# Altium schematic sheet Sheet2.SchDoc
size A4; SheetNumber: 1; SheetTotal: 1; SPICEModelCacheLSWSENKY: <root> / <DocumentId>LSWSENKY</DocumentId> / <CacheFrame Number="0"> / <Model Name="led1" Kind="MDL"> / <Text>*Typ RED GaAs LED: Vf=1.7V Vr=4V If=40mA trr=3uS / *LED Pinout: 1=A, 2=K / .MODEL LED1 D (IS=93.2P RS=42M N=3.73 BV=4 IBV=10U / + CJO=2.97P VJ=.75 M=.333 TT=4.32U)</Text> / </Model> / </CacheFrame> / </root>
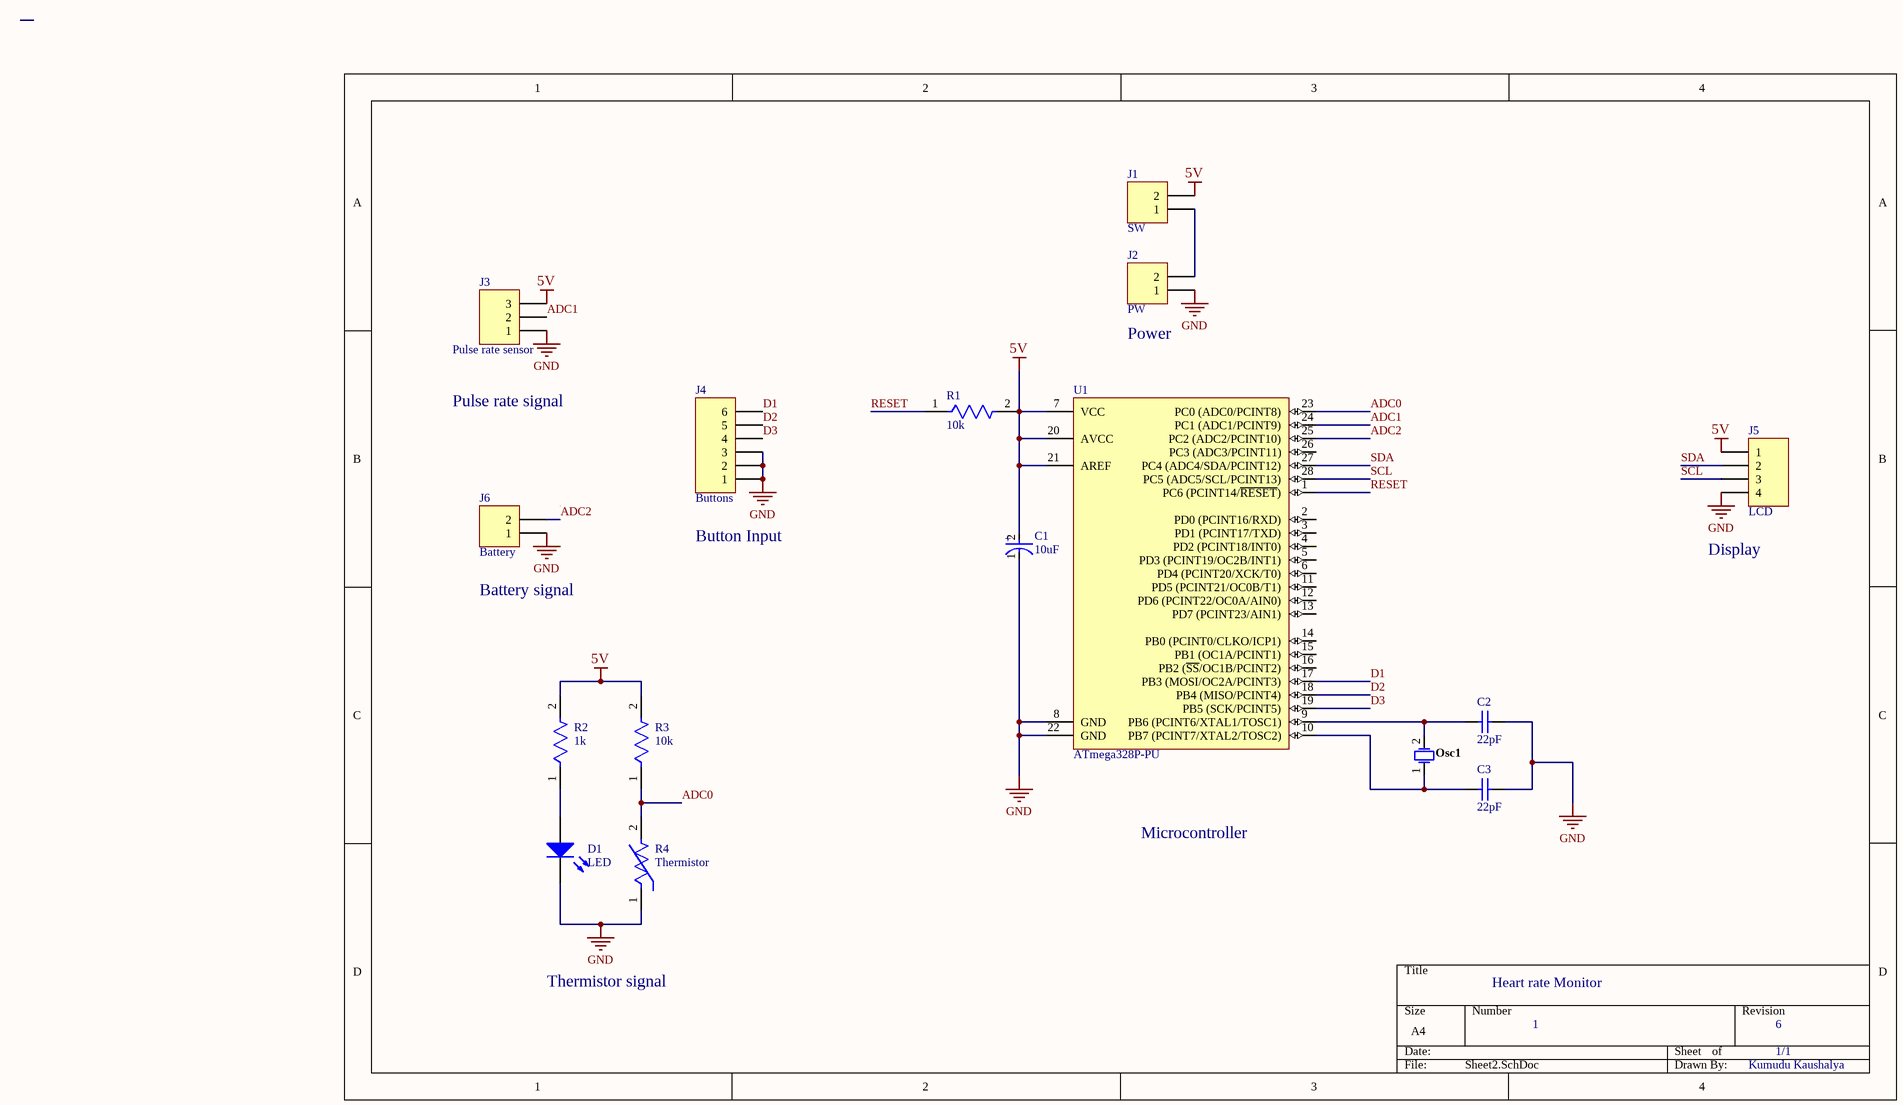
[diagram p0: Sheet2.SchDoc]

## Parts
C1  10uF  [FP-RAD-TH-D_5_0_5-L_11_1-MFG]
C2  22pF  [KEMT-C315-THT-2]
C3  22pF  [KEMT-C315-THT-2]
D1  LED  [LED-1]
J1  SW  [HDR1X2]
J2  PW  [HDR1X2]
J3  Pulse rate sensor  [HDR1X3]
J4  Buttons  [HDR1X6]
J5  LCD  [HDR1X4]
J6  Battery  [HDR1X2]
Osc1  Osc1  [FOX-FOXSLF160-20]  (value not drawn)
R1  10k  [FP-MBB0207-MFG]
R2  1k  [FP-MRS25-MFG]
R3  10k  [FP-MBB0207-MFG]
R4  Thermistor  [FP-NTCLE100E3104JB0-MFG]
U1  ATmega328P-PU  [28P3]

## Nets
5V: C1.2(A) J1.2 J3.3 J5.1 R1.2 R2.2 R3.2 U1.7(VCC) U1.20(AVCC) U1.21(AREF)
GND: C1.1(C) C2.2 C3.2 D1.2(K) J2.1 J3.1 J4.1 J4.2 J4.3 J5.4 J6.1 R4.1 U1.8(GND) U1.22(GND)
ADC0: R3.1 R4.2 U1.23(PC0_(ADC0/PCINT8))
ADC1: J3.2 U1.24(PC1_(ADC1/PCINT9))
ADC2: J6.2 U1.25(PC2_(ADC2/PCINT10))
D1: J4.6 U1.17(PB3_(MOSI/OC2A/PCINT3))
D2: J4.5 U1.18(PB4_(MISO/PCINT4))
D3: J4.4 U1.19(PB5_(SCK/PCINT5))
RESET: R1.1 U1.1(PC6_(PCINT14/~{RESET}))
SCL: J5.3 U1.28(PC5_(ADC5/SCL/PCINT13))
SDA: J5.2 U1.27(PC4_(ADC4/SDA/PCINT12))
NetC2_1: C2.1 Osc1.2 U1.9(PB6_(PCINT6/XTAL1/TOSC1))
NetC3_1: C3.1 Osc1.1 U1.10(PB7_(PCINT7/XTAL2/TOSC2))
NetD1_1: D1.1(A) R2.1
NetJ1_1: J1.1 J2.2

Not connected (* = marked no-connect by the designer): U1 2(PD0_(PCINT16/RXD)) 3(PD1_(PCINT17/TXD)) 4(PD2_(PCINT18/INT0)) 5(PD3_(PCINT19/OC2B/INT1)) 6(PD4_(PCINT20/XCK/T0)) 11(PD5_(PCINT21/OC0B/T1)) 12(PD6_(PCINT22/OC0A/AIN0)) 13(PD7_(PCINT23/AIN1)) 14(PB0_(PCINT0/CLKO/ICP1)) 15(PB1_(OC1A/PCINT1)) 16(PB2_(~{SS}/OC1B/PCINT2)) 26(PC3_(ADC3/PCINT11))

## Notes on the sheet
- (near J2) Power
- Pulse rate signal
- (near J4) Button Input
- (near J5) Display
- (near J6) Battery signal
- Microcontroller
- Thermistor signal
- Heart rate Monitor
- 1
- 6
- 1/1
- Kumudu Kaushalya
- (in symbol CMP-05427-000869-1) +

## Library data of the parts
C1 = CMP-05427-000869-1: Aluminum Electrolytic Capacitors (Radial Lead Type) 10uF ±20% 100V; Polarity: Polar; Lead Diameter: 0.5mm; Dissipation Factor: 0.1%; Leakage Current: 3uA; Dielectric Material: Aluminium; Ripple Current: 70mA; Life (Hours): 2000Hour; Lead/Base Style: Straight; Length: 11mm; Case/Package: Radial; Lead Pitch: 2mm; Contact Plating: Tin; RoHS Compliant: Yes; Radiation Hardening: No; Capacitance: 10uF; Max Operating Temperature: 85°C; Lead Free: Lead Free; Termination: Radial; Voltage Rating: 100V; Package Quantity: 200; Voltage: 100V; Construction: RADIAL; Height: 11mm; Min Operating Temperature: -40°C; Diameter: 5mm; REACH SVHC: No SVHC; Tolerance: 20%; Width: 5mm; Height - Seated (Max): 0.472inch; Mount: Through Hole; Series: M; Voltage Rating (DC): 100V; Packaging: Bulk; Ripple Current (AC): 70mA; Number of Pins: 2
C2 C3 = CMP-1664-00008-1: Capacitor, Ceramic, 22 pF, +/-10 %, 100 V, -55 to 125 degC, 2-Pin THD, RoHS, Bulk; Max Input Voltage: 40 V; Min Input Voltage: 4.2 V; Output Current: 1.5 A; Output Voltage: 1.2 V; Outputs: 1; Case\Package: TO-220; RoHSCompliant: true; Min Operating Temperature: 0 degC; Max Operating Temperature: 125 degC; Package Quantity: 50; ComponentLink2URL: http://capacitoredge.kemet.com/capedge2/DataSheet/Datasheet-C315C220K1G5TA.pdf?pn=C315C220K1G5TA{BULK}; Radiation Hardening: No; Pins: 3; Length: 10.28 mm; ComponentLink1URL: http://www.kemet.com/; ComponentLink2Description: Datasheet; Height: 9.28 mm; REACH SVHC: No SVHC; ComponentLink1Description: Manufacturer URL; Max Ouput Current: 1.5 A; Weight: 0.08113 oz; Packaging: Rail/Tube; DatasheetVersion: Aug-16; Mount: Through Hole; PackageReference: C315-THT-2; Width: 4.82 mm; PackageDescription: 2-Pin Through Hole Device, Body 3.81 x 2.54 mm
D1 = LED1: Typical RED GaAs LED; Published: 8-Jun-2000; LatestRevisionDate: 08-Jul-2005; LatestRevisionNote: Mech Layer 1 removed.; PackageReference: LED-1; Publisher: Altium Limited; PackageDescription: LED; 2 Leads
J1 J2 J6 = Header 2: Header, 2-Pin; LatestRevisionDate: 17-Jul-2002; LatestRevisionNote: Re-released for DXP Platform.; Publisher: Altium Limited
J3 = Header 3: Header, 3-Pin; LatestRevisionDate: 17-Jul-2002; LatestRevisionNote: Re-released for DXP Platform.; Publisher: Altium Limited
J4 = Header 6: Header, 6-Pin; LatestRevisionDate: 17-Jul-2002; LatestRevisionNote: Re-released for DXP Platform.; Publisher: Altium Limited
J5 = Header 4: Header, 4-Pin; LatestRevisionDate: 17-Jul-2002; LatestRevisionNote: Re-released for DXP Platform.; Publisher: Altium Limited
Osc1 = CMP-1749-00003-1: Resistance Weld Thru-Hole Crystal, 16 MHz, -20 to 70 degC, 2-Pin THD, RoHS, Bulk; Voltage Rating: 250 V; Tolerance: 1%; Resistance: 221 kohm; Case\Package: Axial; Power Rating: 250 mW; RoHSCompliant: true; Package Quantity: 200; Packaging: Bulk; Min Operating Temperature: -55 degC; DatasheetVersion: Mar-15; ComponentLink1URL: http://www.foxonline.com/; Max Operating Temperature: 155 degC; PackageReference: FOXSLF160-20; Mount: Through Hole; PackageDescription: 2-Pin Through Hole Device, Body 11.35 x 4.65 mm; ComponentLink1Description: Manufacturer URL; ComponentLink2URL: http://www.foxonline.com/pdfs/hc49slf.pdf; ComponentLink2Description: Datasheet; Length: 0.248 inch
R1 R3 = CMP-02408-000035-1: RES 10K OHM 0.6W 1% AXIAL; Voltage Rating: 300V; Resistance: 10kR; Max Power Dissipation: 600mW; Temperature Coefficient: 50ppm/°C; Radiation Hardening: No; Case/Package: Conformal; Termination: Axial; Military Standard: Not; Length: 6.5mm; Voltage Rating (DC): 300V; RoHS Compliant: Yes; Number of Terminations: 2; Packaging: Tape and Reel; Features: Automotive AEC-Q200; Tolerance: 1%; Min Operating Temperature: -55°C; Power Rating: 600mW; Lead Free: Lead Free; Resistor Type: Metal Film; Construction: Cylindrical; Series: MBB 0207 - Professional; Max Operating Temperature: 155°C; Diameter: 2.5mm; Resistance Tolerance: 1%; Contact Plating: Tin; Technology: THIN FILM
R2 = CMP-02408-000051-1: RES 1K OHM 0.6W 1% AXIAL; Power Rating: 600mW; Lead Diameter: 0.6mm; Voltage Rating (DC): 350V; Resistance: 1kR; Temperature Coefficient: 50ppm/°C; Width: 2.5mm; Military Standard: Not; Package Quantity: 5000; Radiation Hardening: No; Case/Package: Axial; Resistance Tolerance: 1%; Resistor Type: Metal Film; Contact Plating: Tin; Length: 6.5mm; Lead Free: Lead Free; RoHS Compliant: Yes; Mount: Through Hole; Number of Pins: 2; Technology: THIN FILM; Voltage Rating: 350V; Min Operating Temperature: -55°C; Weight: 0.00776oz; Diameter: 2.5mm; Construction: Cylindrical; Series: MRS25; Tolerance: 1%; Packaging: Tape and Reel; Max Operating Temperature: 155°C; Max Power Dissipation: 600mW; Number of Terminations: 2; Termination: Axial
R4 = CMP-02404-000021-1: NTC THERMISTOR 100K OHM 5% BEAD; Lead Diameter: 0.6mm; Accuracy: 1.5%; Max Power Dissipation: 500mW; Lead Length: 17mm; Resistance: 100kR; Package Quantity: 500; Resistance Tolerance: 5%; Height: 9mm; Case/Package: Radial; Depth: 3mm; Lead Free: Lead Free; Tolerance: 5%; Number of Pins: 2; RoHS Compliant: Yes; Lead Pitch: 2.54mm; Min Operating Temperature: -40°C; Termination: Radial; Series: 2322; Length: 3.3mm; Radiation Hardening: No; Mount: Through Hole; Max Operating Temperature: 125°C; Packaging: Bulk
U1 = CMP-0095-00013-2: 8-bit AVR Microcontroller, 32KB Flash, 1KB EEPROM, 2KB SRAM, 28-pin PDIP, Industrial Grade (-40°C to 85°C); RevisionNote: DatasheetVersion updated. URLs added.; PackageVersion: revB, Sep-2001; PackageDescription: 28-lead (0.300"/7.62mm Wide) Plastic Dual Inline Package (PDIP); DatasheetVersion: revD, May-2011; ComponentLink1Description: Manufacturer URL; ComponentLink1URL: http://www.atmel.com/; PackageReference: 28P3; ComponentLink2Description: ATmega48A/48PA/88A/88PA/168A/168PA/328/328P Datasheet; ComponentLink3URL: http://www.atmel.com/dyn/resources/prod_documents/8271S.pdf; ComponentLink2URL: http://www.atmel.com/dyn/resources/prod_documents/8271.pdf; ComponentLink3Description: ATmega48A/48PA/88A/88PA/168A/168PA/328/328P Summary